# EAGLE design Grove - Finger-clip Heart Rate Sensor v1.0 (EAGLE 6.4)

## Sheet 1 of 2
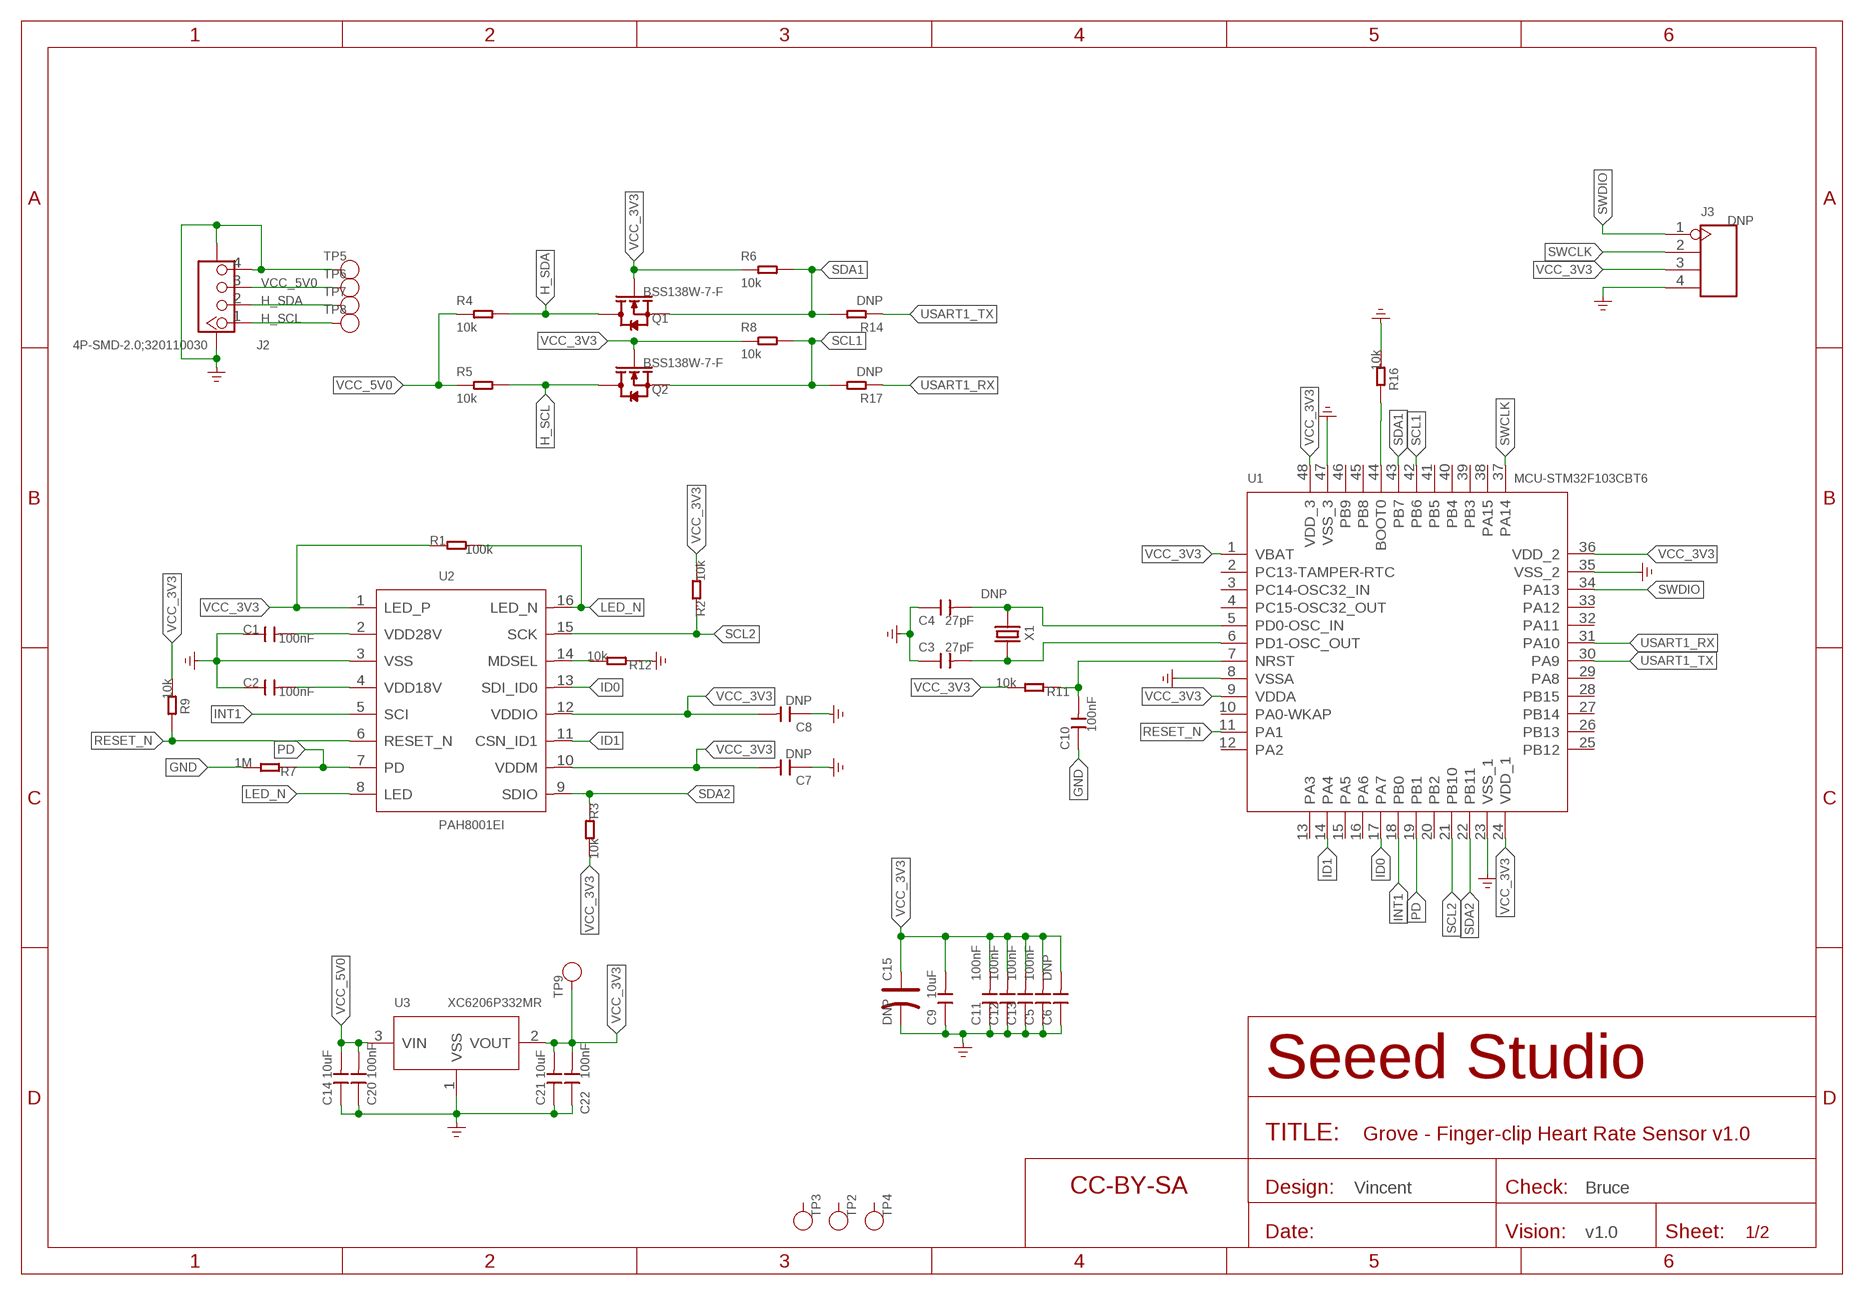
[diagram p0: schematic, sheet 1]

### Parts
C1  100nF  CAP-0402  [C0402]
C2  100nF  CAP-0402  [C0402]
C3  27pF  CAP-0402  [C0402]
C4  27pF  CAP-0402  [C0402]
C5  100nF  CAP-0402  [C0402]
C6  DNP  CAP-0402  [C0402]
C7  DNP  CAP-0402  [C0402]
C8  DNP  CAP-0402  [C0402]
C9  10uF  CAP-0603  [C0603]
C10  100nF  CAP-0402  [C0402]
C11  100nF  CAP-0402  [C0402]
C12  100nF  CAP-0402  [C0402]
C13  100nF  CAP-0402  [C0402]
C14  10uF  CAP-0603  [C0603]
C15  DNP  CAP-POLAR-AVX-A  [AVX-A]
C20  100nF  CAP-0402  [C0402]
C21  10uF  CAP-0603  [C0603]
C22  100nF  CAP-0402  [C0402]
J2  4P-SMD-2.0;320110030  GROVE-CONNECTOR-SMD'DD'  [4P-SMD-2.0]
J3  DNP  HEADER-4P-65/35MIL  [4P-2.54-65/35MIL]
Q1  BSS138W-7-F  MOSFET-N'SI1304BDL'  [SOT-323]
Q2  BSS138W-7-F  MOSFET-N'SI1304BDL'  [SOT-323]
R1  100k  RES-0402  [R0402]
R2  10k  RES-0402  [R0402]
R3  10k  RES-0402  [R0402]
R4  10k  RES-0402  [R0402]
R5  10k  RES-0402  [R0402]
R6  10k  RES-0402  [R0402]
R7  1M  RES-0402  [R0402]
R8  10k  RES-0402  [R0402]
R9  10k  RES-0402  [R0402]
R11  10k  RES-0402  [R0402]
R12  10k  RES-0402  [R0402]
R14  DNP  RES-0402  [R0402]
R16  10k  RES-0402  [R0402]
R17  DNP  RES-0402  [R0402]
TP2  DNP  PAD-TEST-POINT'4545'  [TP-D45MIL]
TP3  DNP  PAD-TEST-POINT'4545'  [TP-D45MIL]
TP4  DNP  PAD-TEST-POINT'4545'  [TP-D45MIL]
TP5  DNP  PAD-TEST-POINT'4545'  [TP-D45MIL]
TP6  DNP  PAD-TEST-POINT'4545'  [TP-D45MIL]
TP7  DNP  PAD-TEST-POINT'4545'  [TP-D45MIL]
TP8  DNP  PAD-TEST-POINT'4545'  [TP-D45MIL]
TP9  DNP  PAD-TEST-POINT'4545'  [TP-D45MIL]
U1  MCU-STM32F103CBT6  TEMPLATE_MCU-STM32F103CBT6  [TEMPLATE_LQFP48]
U2  PAH8001EI  PAH8001EI-QG  [16P-SMD-L4.7*W3*H1MM]
U3  XC6206P332MR  PMIC-XC6206PMR  [SOT-23]
U$1  SEEEDSTUDIO-OPEN-SCH-FRAME  [SEEEDSTUDIO-PCB-FRAME]
X1  DNP  CRYSTAL'5032'  [2P-SMD-L5.0*W3.2MM]

### Nets
BOOT0: R16.2 U1.44(BOOT0)
GND: C1.1 C2.1 C3.1 C4.1 C5.1 C6.1 C7.1 C8.1 C9.1 C10.1 C11.1 C12.1 C13.1 C14.1 C15.- C20.1 C21.1 C22.1 J2.4 J2.SS1 J2.SS2 J3.4 R7.2 R12.1 R16.1 TP5.T U1.8(VSSA) U1.23(VSS_1) U1.35(VSS_2) U1.47(VSS_3) U2.3(VSS) U3.1(VSS) ; supply symbol labelled GND_POWER
H_SCL: J2.1 Q2.3(D) R5.2 TP8.T
H_SDA: J2.2 Q1.3(D) R4.2 TP7.T
ID0: U1.17(PA7) U2.13(SDI_ID0)
ID1: U1.14(PA4) U2.11(CSN_ID1)
INT1: U1.18(PB0) U2.5(SCI)
LED_N: R1.2 U2.8(LED) U2.16(LED_N)
N$5: C4.2 U1.5(PD0-OSC_IN) X1.1
N$6: C3.2 U1.6(PD1-OSC_OUT) X1.2
N$12: R12.2 U2.14(MDSEL)
N$32: C1.2 U2.2(VDD28V)
N$33: C2.2 U2.4(VDD18V)
NRST: C10.2 R11.1 U1.7(NRST)
PD: R7.1 U1.19(PB1) U2.7(PD)
RESET_N: R9.2 U1.11(PA1) U2.6(RESET_N)
SCL1: Q2.2(S) R8.2 R17.2 U1.42(PB6)
SCL2: R2.1 U1.21(PB10) U2.15(SCK)
SDA1: Q1.2(S) R6.2 R14.2 U1.43(PB7)
SDA2: R3.1 U1.22(PB11) U2.9(SDIO)
SWCLK: J3.2 U1.37(PA14)
SWDIO: J3.1 U1.34(PA13)
USART1_RX: R17.1 U1.31(PA10)
USART1_TX: R14.1 U1.30(PA9)
VCC_3V3: C5.2 C6.2 C7.2 C8.2 C9.2 C11.2 C12.2 C13.2 C15.+ C21.2 C22.2 J3.3 Q1.1(G) Q2.1(G) R1.1 R2.2 R3.2 R6.1 R8.1 R9.1 R11.2 TP9.T U1.1(VBAT) U1.9(VDDA) U1.24(VDD_1) U1.36(VDD_2) U1.48(VDD_3) U2.1(LED_P) U2.10(VDDM) U2.12(VDDIO) U3.2(VOUT)
VCC_5V0: C14.2 C20.2 J2.3 R4.1 R5.1 TP6.T U3.3(VIN)
Unconnected: TP2.T TP3.T TP4.T U1.2(PC13-TAMPER-RTC) U1.3(PC14-OSC32_IN) U1.4(PC15-OSC32_OUT) U1.10(PA0-WKAP) U1.12(PA2) U1.13(PA3) U1.15(PA5) U1.16(PA6) U1.20(PB2) U1.25(PB12) U1.26(PB13) U1.27(PB14) U1.28(PB15) U1.29(PA8) U1.32(PA11) U1.33(PA12) U1.38(PA15) U1.39(PB3) U1.40(PB4) U1.41(PB5) U1.45(PB8) U1.46(PB9)

### Notes on the sheet
- Vincent | Bruce
- v1.0

## Sheet 2 of 2

## Library data of the parts
C1-C14 C20-C22 = Discrete-new:CAP: Ceramic Capacitors
C15 = Discrete-new:CAP-POLAR: Electrolytic Capacitors,Tantalum Capacitors and Super Capacitors
J2 = Connector-new:GROVE-CONNECTOR-SMD: 4P-SMD-2.0:320110030;4P-SMD-2.0-90D:320110032
J3 = Connector-new:HEADER-4P
Q1 Q2 = Discrete-new:MOSFET-N: IRLL014: http://www.vishay.com/docs/91319/sihll014.pdf
R1-R9 R11 R12 R14 R16 R17 = Discrete-new:RES
TP2-TP9 = Discrete-new:PAD-TEST-POINT; PARTNO: DNP
U1 = template:TEMPLATE_MCU-STM32F103CBT6: Medium-density performance line ARM-based 32-bit MCU with 64 or 128 KB Flash, USB, CAN, 7 timers, 2 ADCs, 9 com. interfaces
U2 = template:PAH8001EI-QG: Optical Heart Rate Detection Sensor
U3 = IC-new:PMIC-XC6206P: LOW ESR Cap.Compatible Positive Voltage Regulators
U$1 = moudle-new:SEEEDSTUDIO-OPEN-SCH-FRAME
X1 = Discrete-new:CRYSTAL

## Net classes
0 default: width 0.152 mm, drill 0.305 mm, clearance 0.152 mm

## Board
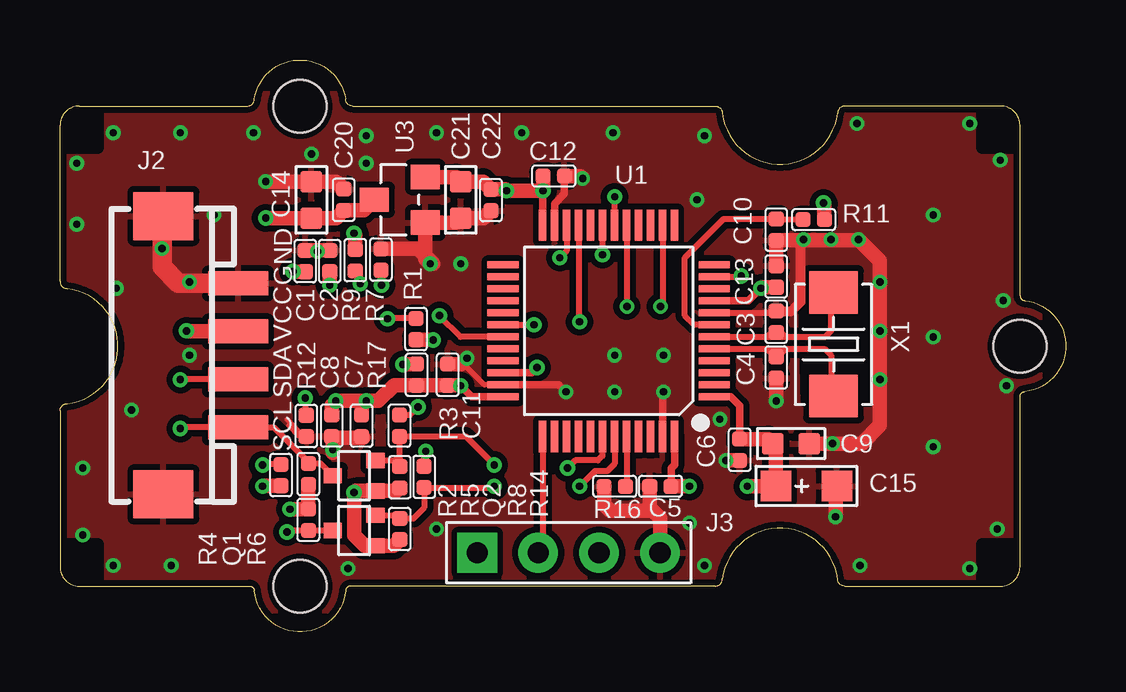
[diagram p1: board, top side]
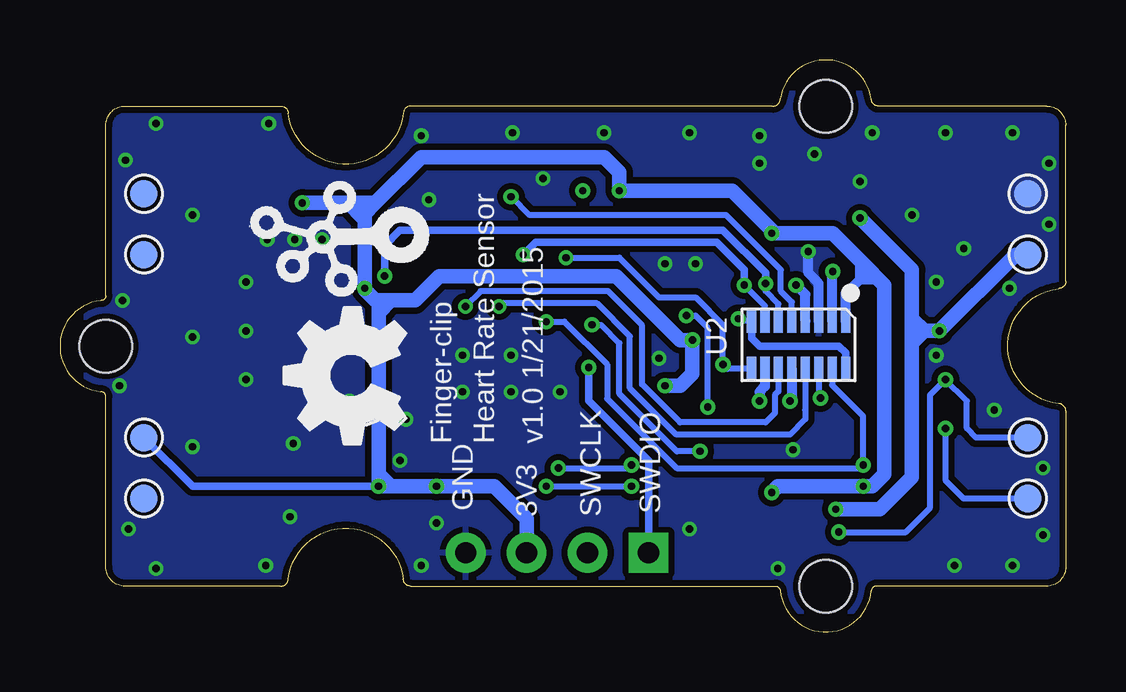
[diagram p2: board, bottom side, seen from below]

Size 41.91 x 23.83 mm. Coordinates in mm from the lower left corner, seen from the top.
Copper layers (1*16): Top 0.035mm / dielectric 1.5mm / Bottom 0.035mm
Design rules "SeeedStudio_2layer_DRU_no_angle_20140221 *": minimum track width 6mil, minimum drill 12mil, track to track 6mil, track to pad 6mil, pad to pad 6mil, via to via 6mil, smd to smd 0mil, copper to edge 10mil, drill to drill 10mil, minimum pad ring 10mil, minimum via ring 6mil, stop-mask expansion 2mil, vias tented up to drill 25mil, thermal gap 10mil

### Footprints (pad centres in the part's own frame; a part is rotated, then mirrored left to right if it is on the bottom)
C0402 = smd 0.635 x 0.635: 1 -0.445,0; 2 0.445,0
C0603 = smd 0.889 x 0.889: 1 -0.762,0; 2 0.762,0
AVX-A = smd 1.27 x 1.27: + -1.27,0; - 1.27,0
4P-SMD-2.0 = smd 1 x 2.5: 1 -3,0; 2 -1,0; 3 1,0; 4 3,0 | smd 2 x 2.5: SS1 -5.8,3.123; SS2 5.8,3.123
4P-2.54-65/35MIL = drill 0.889 pad 1.651 square: 1 0,3.81 | drill 0.889 pad 1.651: 2 0,1.27; 3 0,-1.27; 4 0,-3.81
SOT-323 = smd 0.635 x 0.762: 1 -0.635,-0.889; 2 0.635,-0.889; 3 0,0.889
R0402 = smd 0.635 x 0.635: 1 -0.445,0; 2 0.445,0
TP-D45MIL = smd 1.143 x 1.143: T 0,0
TEMPLATE_LQFP48 = smd 1.3 x 0.3: 1 -4.4,2.75; 2 -4.4,2.25; 3 -4.4,1.75; 4 -4.4,1.25; 5 -4.4,0.75; 6 -4.4,0.25; 7 -4.4,-0.25; 8 -4.4,-0.75; 9 -4.4,-1.25; 10 -4.4,-1.75; 11 -4.4,-2.25; 12 -4.4,-2.75; 25 4.4,-2.75; 26 4.4,-2.25; 27 4.4,-1.75; 28 4.4,-1.25; 29 4.4,-0.75; 30 4.4,-0.25; 31 4.4,0.25; 32 4.4,0.75; 33 4.4,1.25; 34 4.4,1.75; 35 4.4,2.25; 36 4.4,2.75 | smd 0.3 x 1.3: 13 -2.75,-4.4; 14 -2.25,-4.4; 15 -1.75,-4.4; 16 -1.25,-4.4; 17 -0.75,-4.4; 18 -0.25,-4.4; 19 0.25,-4.4; 20 0.75,-4.4; 21 1.25,-4.4; 22 1.75,-4.4; 23 2.25,-4.4; 24 2.75,-4.4; 37 2.75,4.4; 38 2.25,4.4; 39 1.75,4.4; 40 1.25,4.4; 41 0.75,4.4; 42 0.25,4.4; 43 -0.25,4.4; 44 -0.75,4.4; 45 -1.25,4.4; 46 -1.75,4.4; 47 -2.25,4.4; 48 -2.75,4.4
16P-SMD-L4.7*W3*H1MM = smd 0.38 x 1: 1 -1.96,-1; 2 -1.4,-1; 3 -0.84,-1; 4 -0.28,-1; 5 0.28,-1; 6 0.84,-1; 7 1.4,-1; 8 1.96,-1; 9 1.96,1; 10 1.4,1; 11 0.84,1; 12 0.28,1; 13 -0.28,1; 14 -0.84,1; 15 -1.4,1; 16 -1.96,1
SOT-23 = smd 1.016 x 1.2: 1 -0.95,-1.06; 2 0.95,-1.06; 3 0,1.06
GROVE-TEST-PLATFORM = hole 2.2: -10,-10; -10,10; 20,0
GROVE-1*2-TEST-PLATFORM = hole 2.2: -10,-10; -10,10; 20,0
2P-SMD-L5.0*W3.2MM = smd 1.778 x 2.032: 1 -2.159,0; 2 2.159,0

### Placement (x,y rotation side)
C1  10.22,15.45 270 top
C2  11.24,15.45 270 top
C3  29.84,12.92 270 top
C4  29.84,11.02 90 top
C5  25.02,6.07 0 top
C6  28.32,7.59 90 top
C7  12.57,8.59 90 top
C8  11.32,8.59 90 top
C9  30.46,7.84 180 top
C10  29.84,16.76 90 top
C11  16.15,10.71 270 top
C12  20.57,18.99 180 top
C13  29.84,14.8 270 top
C14  10.47,18 270 top
C15  31.1,6.08 0 top
C20  11.82,18 270 top
C21  16.7,18 90 top
C22  17.96,17.99 90 top
J2  7.43,11.53 90 top
J3  21.19,3.3 90 top
Q1  12.25,4.22 90 top
Q2  12.25,6.51 90 top
R1  14.83,12.62 90 top
R2  9.2,6.54 270 top
R3  14.86,10.71 270 top
R4  10.35,4.67 270 top
R5  10.35,6.57 90 top
R6  14.16,4.29 90 top
R7  13.37,15.51 90 top
R8  14.16,6.45 90 top
R9  12.3,15.49 270 top
R11  31.4,17.18 0 top
R12  10.26,8.58 90 top
R14  15.17,6.46 270 top
R16  23.11,6.07 0 top
R17  14.15,8.59 270 top
TP2  38.41,18.26 0 bottom
TP3  38.41,15.72 0 bottom
TP4  38.41,5.56 0 bottom
TP5  1.58,18.26 0 bottom
TP6  1.58,15.72 0 bottom
TP7  1.58,8.1 0 bottom
TP8  1.58,5.56 0 bottom
TP9  38.41,8.1 0 bottom
U1  22.86,12.54 180 top
U2  11.14,11.96 180 bottom
U3  14.16,18 90 top
U11  [GROVE-TEST-PLATFORM]  20,11.91 0 top
U$1  -5.53,-11.33 0 top  (outside the outline)
U$6  [GROVE-1*2-TEST-PLATFORM]  20,11.91 0 top
U$16  [GROVE-SILK-BIG]  27.49,16.48 90 bottom
U$17  [OSHW_FILLX200_NOTEXT]  27.49,7.84 90 bottom
X1  32.23,11.98 90 top

### Tracks (layer width: path | path; a pad name or v marks a point on that pad's centre or on a via)
BOOT0
  Top 0.254: U1.44 23.61,6.12 R16.2
GND  (via drill 0.3)
  Top 0.203: R12.1 10.18,8.14 | 10.18,8.14 9.46,8.86 | 10.18,8.14 9.99,8.14 9.52,8.61 | U1.35 17.68,10.29 16.95,11.02 v16.95,11.4
  Top 0.254: U1.8 29.77,13.29 C3.1
  Top 0.305: U1.23 20.61,17.85 21.02,18.26 C12.1 | U1.47 25.11,9.97 v25.14,10 | v21.08,10 20.79,10.29 U1.35
  Top 0.406: v30.98,16.35 30.86,16.23 30.86,13.75 30.48,13.37 C3.1
  Top 0.61: C6.1 v27.75,7.15 | 11.36,8.15 11.36,8.1 | 11.36,8.1 11.36,7.46 | 11.36,8.1 12.63,8.1 | C11.1 16.71,11.16 v16.95,11.4 | C1.1 C2.1 | C22.1 17.65,17.24 C21.1 16.51,17.05 U3.1 15.22,15.55 v15.43,15.34 | C4.1 v29.84,9.62 | C9.1 v32.19,7.84 33.4,7.84 34.16,8.61 34.16,15.46 33.31,16.32 C10.1 C13.1 | 15.03,15.96 15.17,16.1 | C20.1 11.5,18.77 C14.1 v8.57,18.77 | R16.1 22.67,5.3 22.92,5.05 24.57,5.05 | 24.57,5.05 24.7,5.05 25,4.75 J3.4 | C5.1 24.57,5.05 | v32.32,4.8 32.32,6.03 C15.- | C12.1 21.68,19 v21.78,18.89 | R7.2 14.93,15.96 15.55,15.34
  Top 0.813: J2.4 4.93,14.53 4.25,15.21 4.25,17.28 J2.SS2
  Bottom 0.406: U2.3 10.29,14.52 10.73,14.96 v10.73,15.85
  other vias: 12.76,20.67 8.06,20.8 5.39,11.53 2.22,2.76 4.63,2.76 33.34,2.76 37.91,2.64 34.16,10.51 34.16,14.58 34.16,12.54 15.68,20.8 19.24,20.8 23.11,10 23.11,11.53 25.14,11.53 32.13,16.35 33.27,16.35 4.25,15.97 0.7,19.53 2.22,20.8 2.35,14.32 0.95,6.83 0.95,4.03 12,2.64 26.22,4.54 39.05,4.29 39.43,10.26 39.3,13.81 37.91,21.18 39.18,19.66 33.21,21.18 26.86,20.67 23.05,20.8 26.54,18 0.7,16.99 11.36,7.59 36.38,17.37 36.38,12.29 36.38,7.72 5.01,20.8 5.39,14.58 10.47,19.91 12.76,19.53 6.41,17.37 15.68,4.29 26.86,2.76 27.49,8.86 2.98,9.24 16.7,15.34
  pour Top (isolate 0.254, rank 6): -1.08,22.45 40.83,22.45 40.83,0.86 -1.08,0.86
  pour Bottom (isolate 0.254, rank 6): -1.08,22.45 40.83,22.45 40.83,0.86 -1.08,0.86
H_SCL  (via drill 0.3 pad 0.64)
  Top 0.254: Q2.3 10.86,7.02 R5.2 10.35,7.08 8.9,8.53 J2.1 5.06,8.53 v5.01,8.48
  Bottom 0.254: TP8.T 4.25,5.56 5.01,6.32 v5.01,8.48
H_SDA  (via drill 0.3 pad 0.64)
  Top 0.254: Q1.3 R4.2 9.52,4.22 v9.46,4.16 | J2.2 5.03,10.53 v5.01,10.51
  Bottom 0.254: v9.46,4.16 6.66,4.16 5.65,5.18 5.65,9.88 v5.01,10.51 4.12,9.62 4.12,8.48 3.74,8.1 TP7.T
ID0  (via drill 0.3)
  Top 0.254: U1.17 23.62,16.93 v23.62,13.56
  Bottom 0.254: U2.13 10.85,9.24 | 10.86,9.24 10.85,9.24 | 10.85,9.24 10.85,8.86 11.49,8.23 16.22,8.23 18.16,10.16 18.16,12.31 19.53,13.69 23.49,13.69 v23.62,13.56
ID1  (via drill 0.3)
  Top 0.254: U1.14 25.11,13.65 v25.02,13.56
  Bottom 0.254: U2.11 11.97,10.03 12.13,9.88 12.13,9.11 12.51,8.73 16.07,8.73 17.65,10.31 17.65,12.77 19.07,14.19 24.38,14.19 v25.02,13.56
INT1  (via drill 0.3 pad 0.64)
  Top 0.254: U1.18 v23.11,18.13
  Bottom 0.254: U2.5 11.41,13.74 11.87,14.19 11.87,15.08 14.16,17.37 22.35,17.37 v23.11,18.13
LED_N  (via drill 0.3 pad 0.64)
  Top 0.254: R1.2 13.66,13.06 v13.65,13.05
  Bottom 0.254: U2.8 13.56,12.96 v13.65,13.05
  Bottom 0.305: U2.8 13.09,12.24 12.76,11.91 9.46,11.91 9.17,11.62 U2.16
N$5
  Top 0.254: U1.5 29.45,11.79 | 29.45,11.79 29.97,11.79 | 29.97,11.79 31.86,11.79 32.13,11.53 32.13,9.93 X1.1 | C4.2 29.84,11.67 29.97,11.79 | 29.45,11.79 29.72,11.53 29.97,11.53 30.22,11.78 29.72,11.78
N$6
  Top 0.254: U1.6 29.47,12.29 | 29.47,12.29 29.66,12.29 | 29.78,12.54 C3.2 29.66,12.29 | 29.66,12.29 31.88,12.29 32.13,12.54 32.13,14.04 X1.2 | 29.47,12.29 29.72,12.54 29.97,12.54 30.22,12.29 30.35,12.29
N$9
  cutout Top: 30.86,14.45 33.78,14.45 33.78,9.5 30.99,9.5
N$12  (via drill 0.3 pad 0.64)
  Top 0.254: v10.22,9.75 10.22,9.06 R12.2
  Bottom 0.254: U2.14 10.29,9.82 v10.22,9.75
N$32  (via drill 0.3 pad 0.64)
  Top 0.61: C1.2 9.73,15.01 v9.71,15.02
  Bottom 0.406: U2.2 9.73,15 v9.71,15.02
N$33  (via drill 0.3 pad 0.64)
  Top 0.61: C2.2 v11.24,14.45
  Bottom 0.406: U2.4 10.85,14.07 v11.24,14.45
NRST
  Top 0.254: U1.7 26.42,12.79 26.03,13.18 26.03,15.59 27.64,17.2 C10.2 | 29.75,17.12 C10.2 | C10.2 30.93,17.2 R11.1
PD  (via drill 0.3 pad 0.64)
  Top 0.254: U1.19 v22.6,15.72 | R7.1 13.37,14.47 v13.4,14.45
  Bottom 0.254: U2.7 12.53,13.59 v13.4,14.45
  Bottom 0.305: v13.4,14.45 13.4,15.08 14.54,16.23 22.1,16.23 v22.6,15.72
RESET_N  (via drill 0.3 pad 0.64)
  Top 0.254: v12.51,14.51 12.51,14.84 R9.2 | U1.11 28.35,14.79 v28.38,14.83
  Bottom 0.254: U2.6 11.97,13.66 12.51,14.19 v12.51,14.51
  Bottom 0.305: v28.38,14.83 28.38,16.1 27.75,16.73 14.28,16.73 12.51,14.96 v12.51,14.51
SCL1  (via drill 0.3 pad 0.64)
  Top 0.254: U1.42 22.6,7.34 22.41,7.15 21.46,7.15 v21.14,6.83 | R8.2 14.16,7.21 | 14.16,7.21 14.16,7.34 | 14.16,7.34 R17.2 16.9,8.15 v18.09,6.96 | Q2.2 13.97,7.15 | 13.97,7.15 14.09,7.15 14.16,7.21 | 13.97,7.15 14.16,7.34
  Bottom 0.254: v21.14,6.83 18.22,6.83 v18.09,6.96
SCL2  (via drill 0.3 pad 0.64)
  Top 0.254: R2.1 8.47,6.98 v8.44,6.96 | U1.21 21.61,12.97 v21.65,12.92
  Bottom 0.254: U2.15 9.73,10.28 8.44,8.99 v8.44,6.96 8.57,6.83 16.21,6.83 19.11,9.72 19.11,11.15 20.89,12.92 v21.65,12.92
SDA1  (via drill 0.3 pad 0.64)
  Top 0.254: Q1.2 14.03,4.86 R6.2 14.73,4.73 15.17,5.18 R14.2 18.04,6.02 v18.09,6.07 | U1.43 23.11,7.01 22.79,6.7 22.29,6.7 v21.65,6.07
  Bottom 0.254: v21.65,6.07 v18.09,6.07
SDA2  (via drill 0.3, 0.3 pad 0.64)
  Top 0.254: U1.22 21.11,15.87 v20.83,15.59
  Top 0.61: R3.1 14.3,11.16 v14.28,11.15
  Bottom 0.254: U2.9 14.1,10.96 v14.28,11.15 14.28,12.8 15.43,13.94 16.95,13.94 18.6,15.59 v20.83,15.59
SWCLK
  Top 0.254: U1.37 20.11,3.48 J3.2
SWDIO  (via drill 0.3 pad 0.64)
  Top 0.305: U1.34 19.65,10.79 v19.87,11.02
  Bottom 0.305: J3.1 17.38,7.13 19.87,9.62 v19.87,11.02
USART1_RX  (via drill 0.3 pad 0.64)
  Top 0.254: R17.1 14.59,9.04 v14.92,9.37 | U1.31 16.69,12.29 v15.81,13.18
  Bottom 0.254: v14.92,9.37 14.92,12.67 15.43,13.18 v15.81,13.18
USART1_TX  (via drill 0.3 pad 0.64)
  Top 0.254: U1.30 v19.74,12.79 v19.75,12.8 | R14.1 15.17,7.46 v15.24,7.53
  Bottom 0.254: v19.75,12.8 19.36,12.8 18.6,12.04 18.6,9.92 16.21,7.53 v15.24,7.53
VCC_3V3  (via drill 0.3 pad 0.64)
  Top 0.305: U1.48 25.61,6.97 25.46,6.83 C5.2 | U1.36 17.16,9.79 v16.7,10.26 | U1.24 20.11,18.37 v20.13,18.39 | U1.9 28.68,13.79 v29.21,14.32 | C6.2 28.32,9.43 27.96,9.79 U1.1
  Top 0.61: C7.2 12.56,9.43 v12.76,9.62 | C8.2 11.32,9.45 v11.49,9.62 v12.76,9.62 | R8.1 14.03,5.88 Q2.1 12.32,5.88 v12.25,5.81 12.25,4.03 12.7,3.59 Q1.1 13.9,3.59 R6.1 | v16.7,10.26 16.68,10.27 C11.2 R3.2 13.92,10.27 13.27,9.62 v12.76,9.62 | U3.2 16.51,18.95 C21.2 17.62,18.77 C22.2 18.55,18.44 v18.6,18.39 v20.13,18.39 C12.2 | R1.1 15.54,12.18 v15.55,12.16 | R11.2 31.85,17.84 v31.81,17.88 | C13.2 29.25,14.36 v29.21,14.32 | R9.1 12.3,16.56 v12.25,16.61 | C6.2 29.51,8.04 C9.2 29.83,7.72 C15.+ 28.65,6.08 v28.64,6.07 | R2.2 8.47,6.09 v8.44,6.07 | v26.22,6.07 C5.2
  Bottom 0.305: v28.64,6.07 36.38,6.07 TP9.T
  Bottom 0.406: U2.12 11.41,9.7 v11.49,9.62 | U2.10 12.53,10.23 12.76,10 v12.76,9.62 | U2.1 9.17,14.1 8.57,14.7 | 8.57,14.7 8.19,15.08 | 8.57,14.7 7.81,14.7 | 8.57,14.7 8.57,15.46
  Bottom 0.61: 28.76,17.88 26.86,19.78 19.24,19.78 18.6,19.15 v18.6,18.39 13.9,18.39 12.25,16.73 v12.25,16.61 9.71,16.61 8.57,15.46 8.19,15.08 7.81,14.7 7.55,14.45 7.55,6.57 8.06,6.07 v8.44,6.07 12,6.07 v12.25,5.81 | 28.76,17.88 29.21,17.43 v29.21,14.32 29.21,14.26 28.76,13.81 28.64,13.81 | v31.81,17.88 29.91,17.88 | 29.91,17.88 28.76,17.88 | 29.91,17.88 29.27,17.24 | 28.64,6.57 v28.64,6.07 28.25,6.07 | 28.64,6.57 28.64,13.31 | 28.64,13.31 28.64,13.81 | 28.64,13.81 28.13,13.81 | 28.13,13.81 27.11,13.81 26.1,14.83 18.73,14.83 16.06,12.16 v15.55,12.16 15.55,10.77 16.06,10.26 v16.7,10.26 | 28.64,13.31 28.13,13.81 | J3.3 22.46,4.72 23.81,6.07 v26.22,6.07 28.25,6.07 | 28.25,6.07 28.25,6.19 28.64,6.57
VCC_5V0  (via drill 0.3 pad 0.64)
  Top 0.61: v9.59,5.11 R4.1 R5.1 | J2.3 5.28,12.53 v5.27,12.54 | v8.57,17.24 C14.2 11.5,17.24 C20.2 12.65,17.56 U3.3
  Bottom 0.61: TP6.T 2.09,15.72 v5.27,12.54 5.9,12.54 | v9.59,5.11 7.74,5.11 6.41,6.45 6.41,12.04 | 6.41,12.04 6.41,12.54 | 6.41,12.54 6.41,13.05 | 6.41,13.05 6.41,15.08 v8.57,17.24 | 5.9,12.54 6.41,12.54 | 5.9,12.54 6.41,13.05 | 5.9,12.54 6.41,12.04

### Text on the board
tPlace: GND | VCC | SDA | SCL
bPlace: v1.0 1/21/2015 | Heart Rate Sensor | Finger-clip | SWDIO | SWCLK | 3V3 | GND